# EAGLE design FatLight (EAGLE 7.2.0)

## Sheet 1 of 4: Prozessor
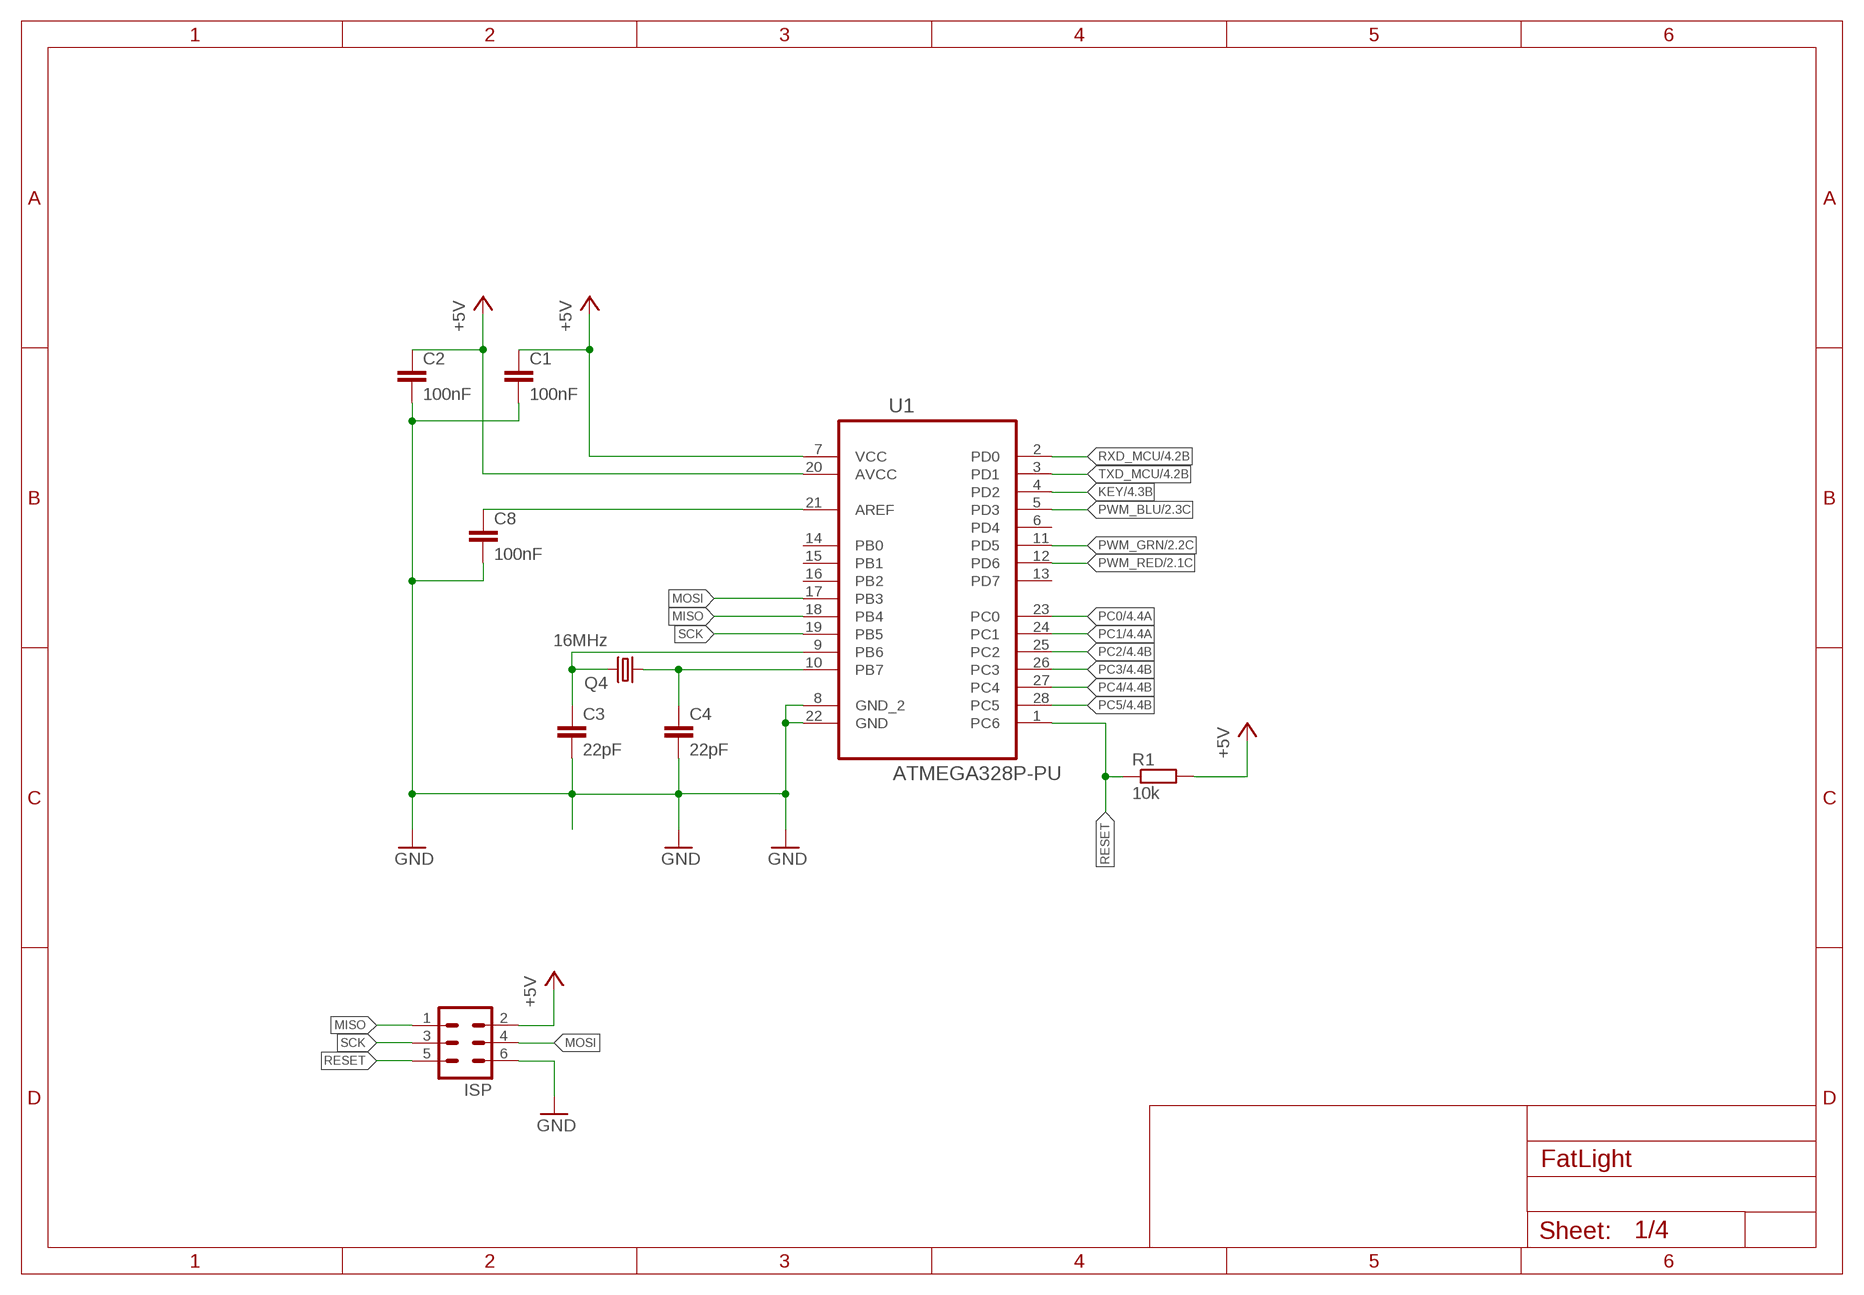
[diagram p0: schematic, sheet 1]

### Parts
C1  100nF  C-EU025-025X050  [C025-025X050]
C2  100nF  C-EU025-025X050  [C025-025X050]
C3  22pF  C-EU025-025X050  [C025-025X050]
C4  22pF  C-EU025-025X050  [C025-025X050]
C8  100nF  C-EU025-025X050  [C025-025X050]
ISP  ML6  [ML6]
Q4  16MHz  CRYSTALHC49S  [HC49/S]
R1  10k  R-EU_0207/7  [0207/7]
U1  ATMEGA328P-PU  [DIP254P762X457-28]

### Nets
+5V: C1.1 C2.1 ISP.2 R1.2 U1.7(VCC) U1.20(AVCC) ; also sheet 3,4
GND: C1.2 C2.2 C3.2 C4.2 C8.2 ISP.6 U1.8(GND_2) U1.22(GND) ; also sheet 2,3,4
KEY: U1.4(PD2) ; also sheet 4
MISO: ISP.1 U1.18(PB4)
MOSI: ISP.4 U1.17(PB3)
N$1: C4.1 Q4.1 U1.10(PB7)
N$2: C3.1 Q4.2 U1.9(PB6)
N$5: C8.1 U1.21(AREF)
PC0: U1.23(PC0) ; also sheet 4
PC1: U1.24(PC1) ; also sheet 4
PC2: U1.25(PC2) ; also sheet 4
PC3: U1.26(PC3) ; also sheet 4
PC4: U1.27(PC4) ; also sheet 4
PC5: U1.28(PC5) ; also sheet 4
PWM_BLU: U1.5(PD3) ; also sheet 2
PWM_GRN: U1.11(PD5) ; also sheet 2
PWM_RED: U1.12(PD6) ; also sheet 2
RESET: ISP.5 R1.1 U1.1(PC6)
RXD_MCU: U1.2(PD0) ; also sheet 4
SCK: ISP.3 U1.19(PB5)
TXD_MCU: U1.3(PD1) ; also sheet 4
Unconnected: U1.6(PD4) U1.13(PD7) U1.14(PB0) U1.15(PB1) U1.16(PB2)

## Sheet 2 of 4: PWM und Ausgabe
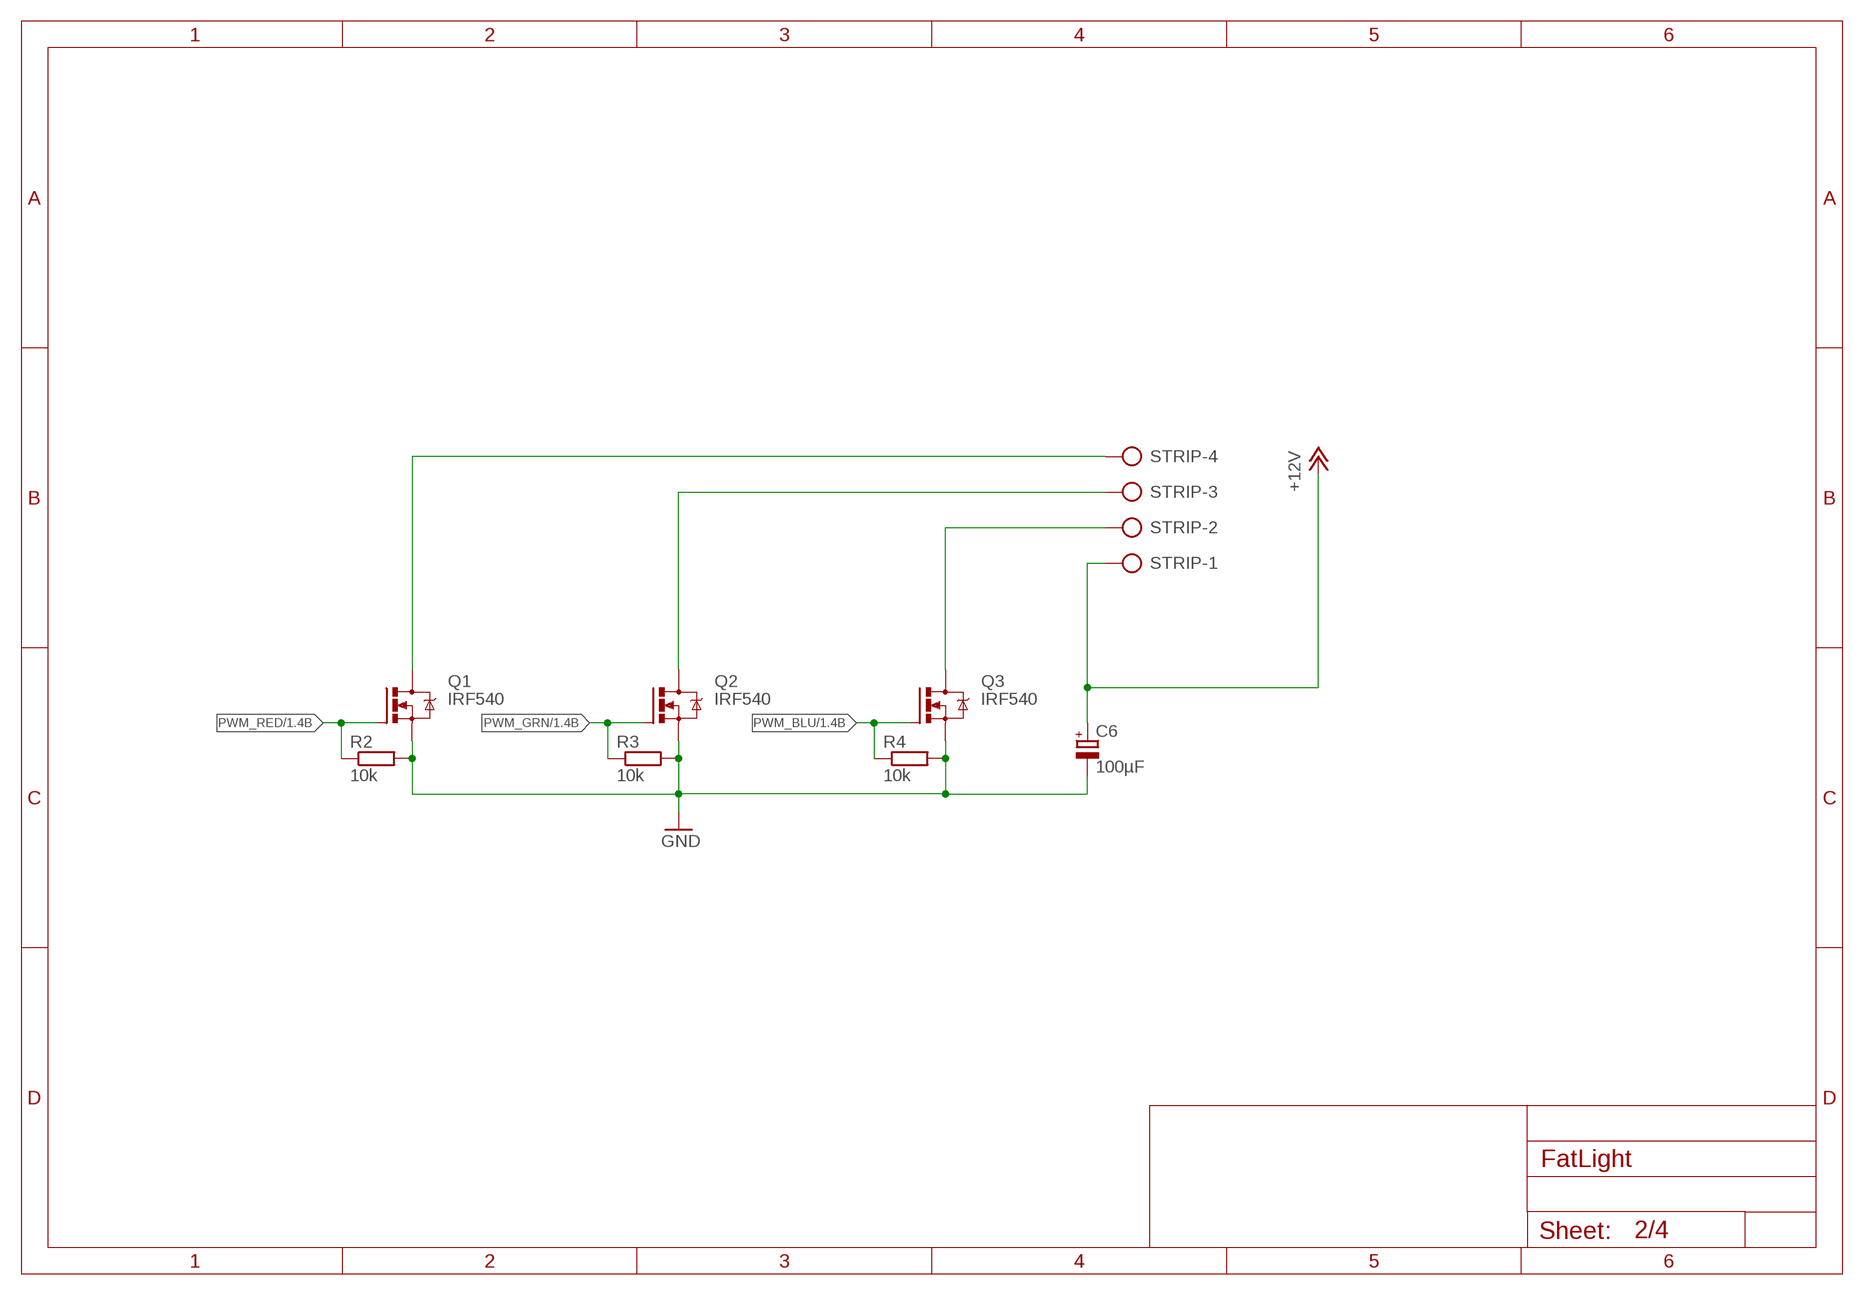
[diagram p1: schematic, sheet 2]

### Parts
C6  100µF  CPOL-EUE2.5-5  [E2,5-5]
Q1  IRF540  [TO220BV]
Q2  IRF540  [TO220BV]
Q3  IRF540  [TO220BV]
R2  10k  R-EU_0207/7  [0207/7]
R3  10k  R-EU_0207/7  [0207/7]
R4  10k  R-EU_0207/7  [0207/7]
STRIP  AK500/4  [AK500/4]

### Nets
+12V: C6.+ STRIP.1 ; also sheet 3
GND: C6.- Q1.S Q2.S Q3.S R2.2 R3.2 R4.2 ; also sheet 1,3,4
PWM_BLU: Q3.G R4.1 ; also sheet 1
PWM_GRN: Q2.G R3.1 ; also sheet 1
PWM_RED: Q1.G R2.1 ; also sheet 1
STRIP_BLU: Q3.D STRIP.2
STRIP_GRN: Q2.D STRIP.3
STRIP_RED: Q1.D STRIP.4

## Sheet 3 of 4: Stromversorgung
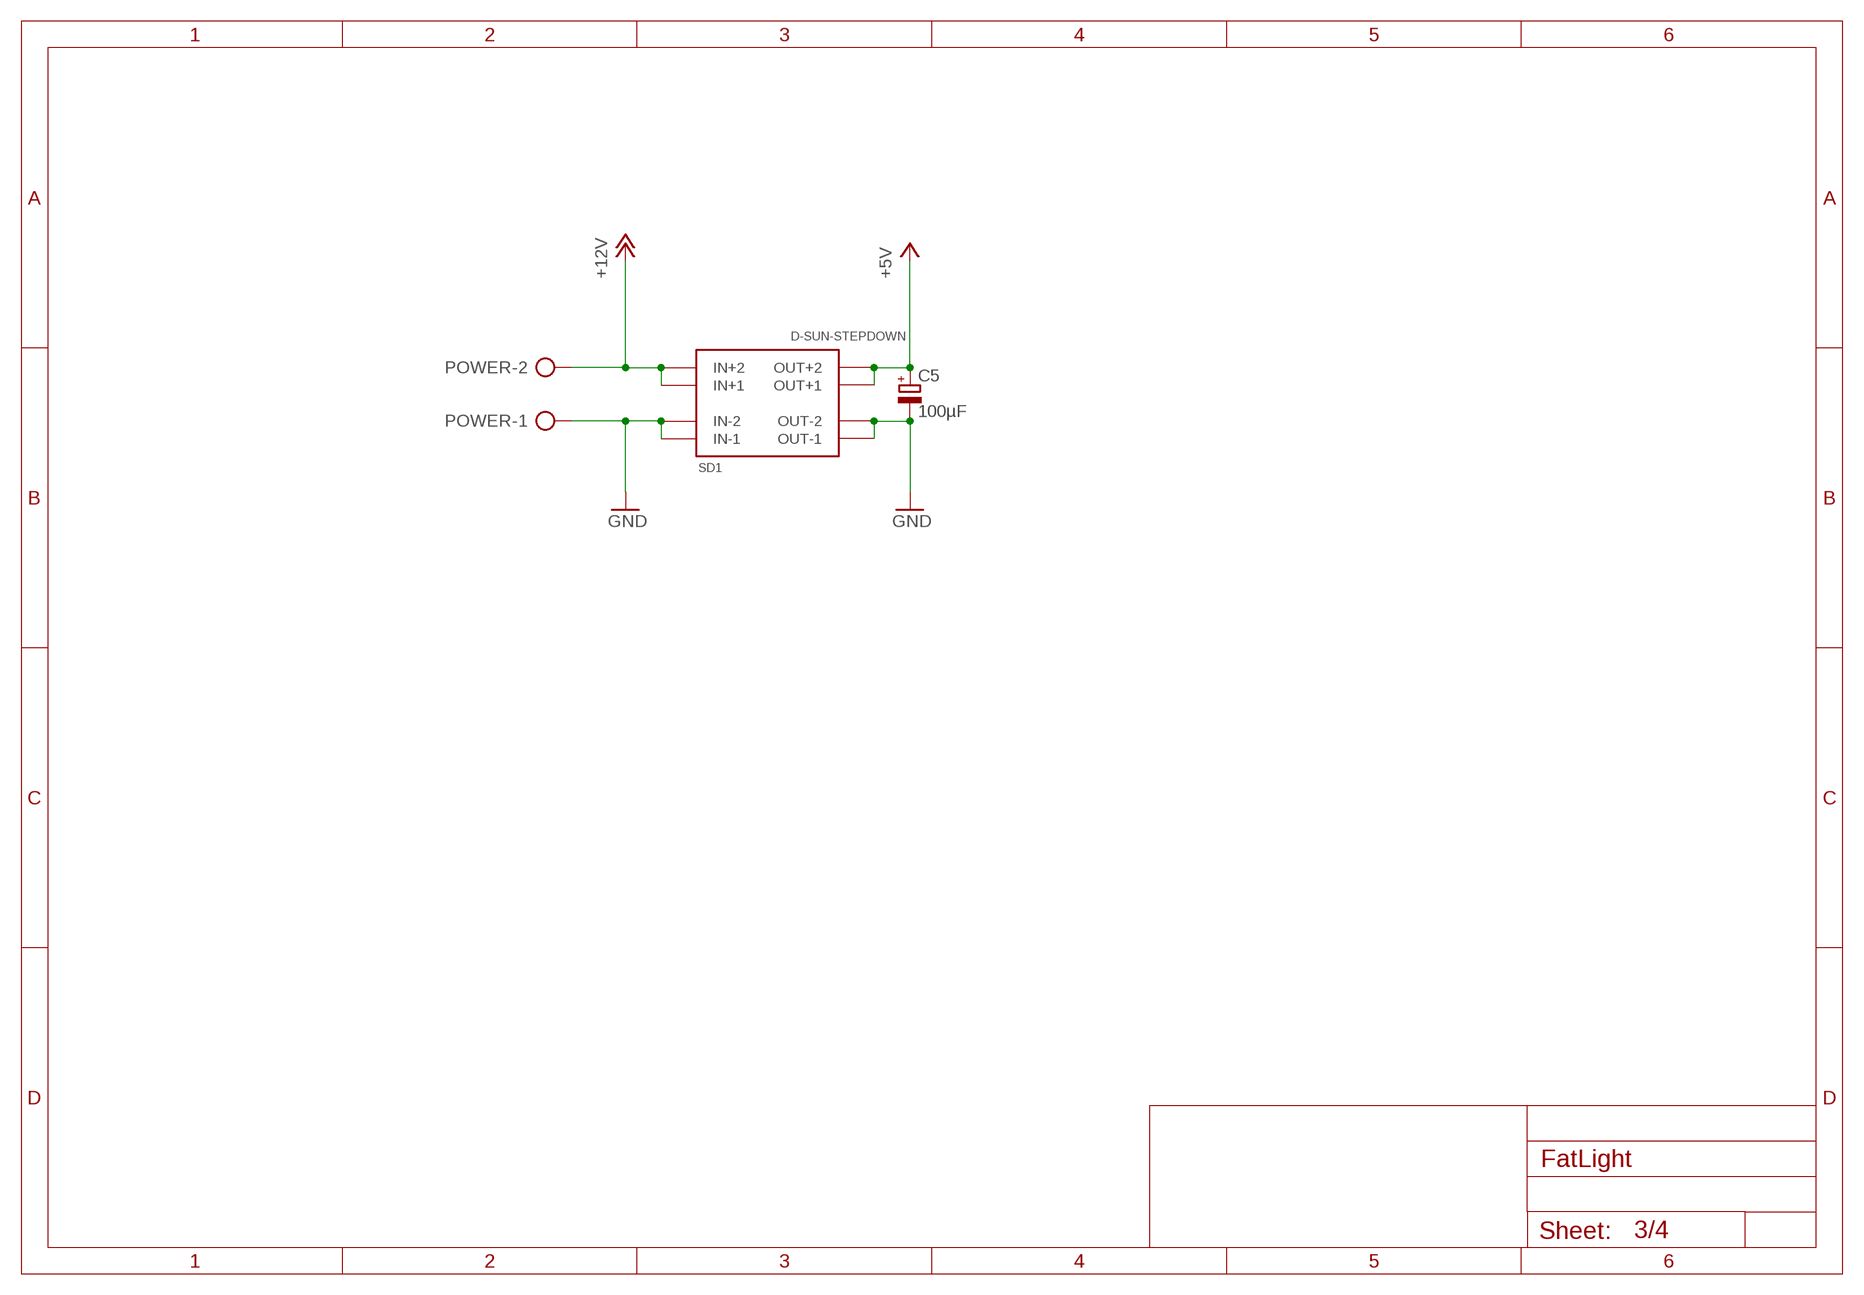
[diagram p2: schematic, sheet 3]

### Parts
C5  100µF  CPOL-EUE2.5-5  [E2,5-5]
POWER  AK500/2  [AK500/2]
SD1  D-SUN-STEPDOWN  [STEPDOWN-21X16]

### Nets
+5V: C5.+ SD1.OUT+1 SD1.OUT+2 ; also sheet 1,4
+12V: POWER.2 SD1.IN+1 SD1.IN+2 ; also sheet 2
GND: C5.- POWER.1 SD1.IN-1 SD1.IN-2 SD1.OUT-1 SD1.OUT-2 ; also sheet 1,2,4

## Sheet 4 of 4: Kommunikation
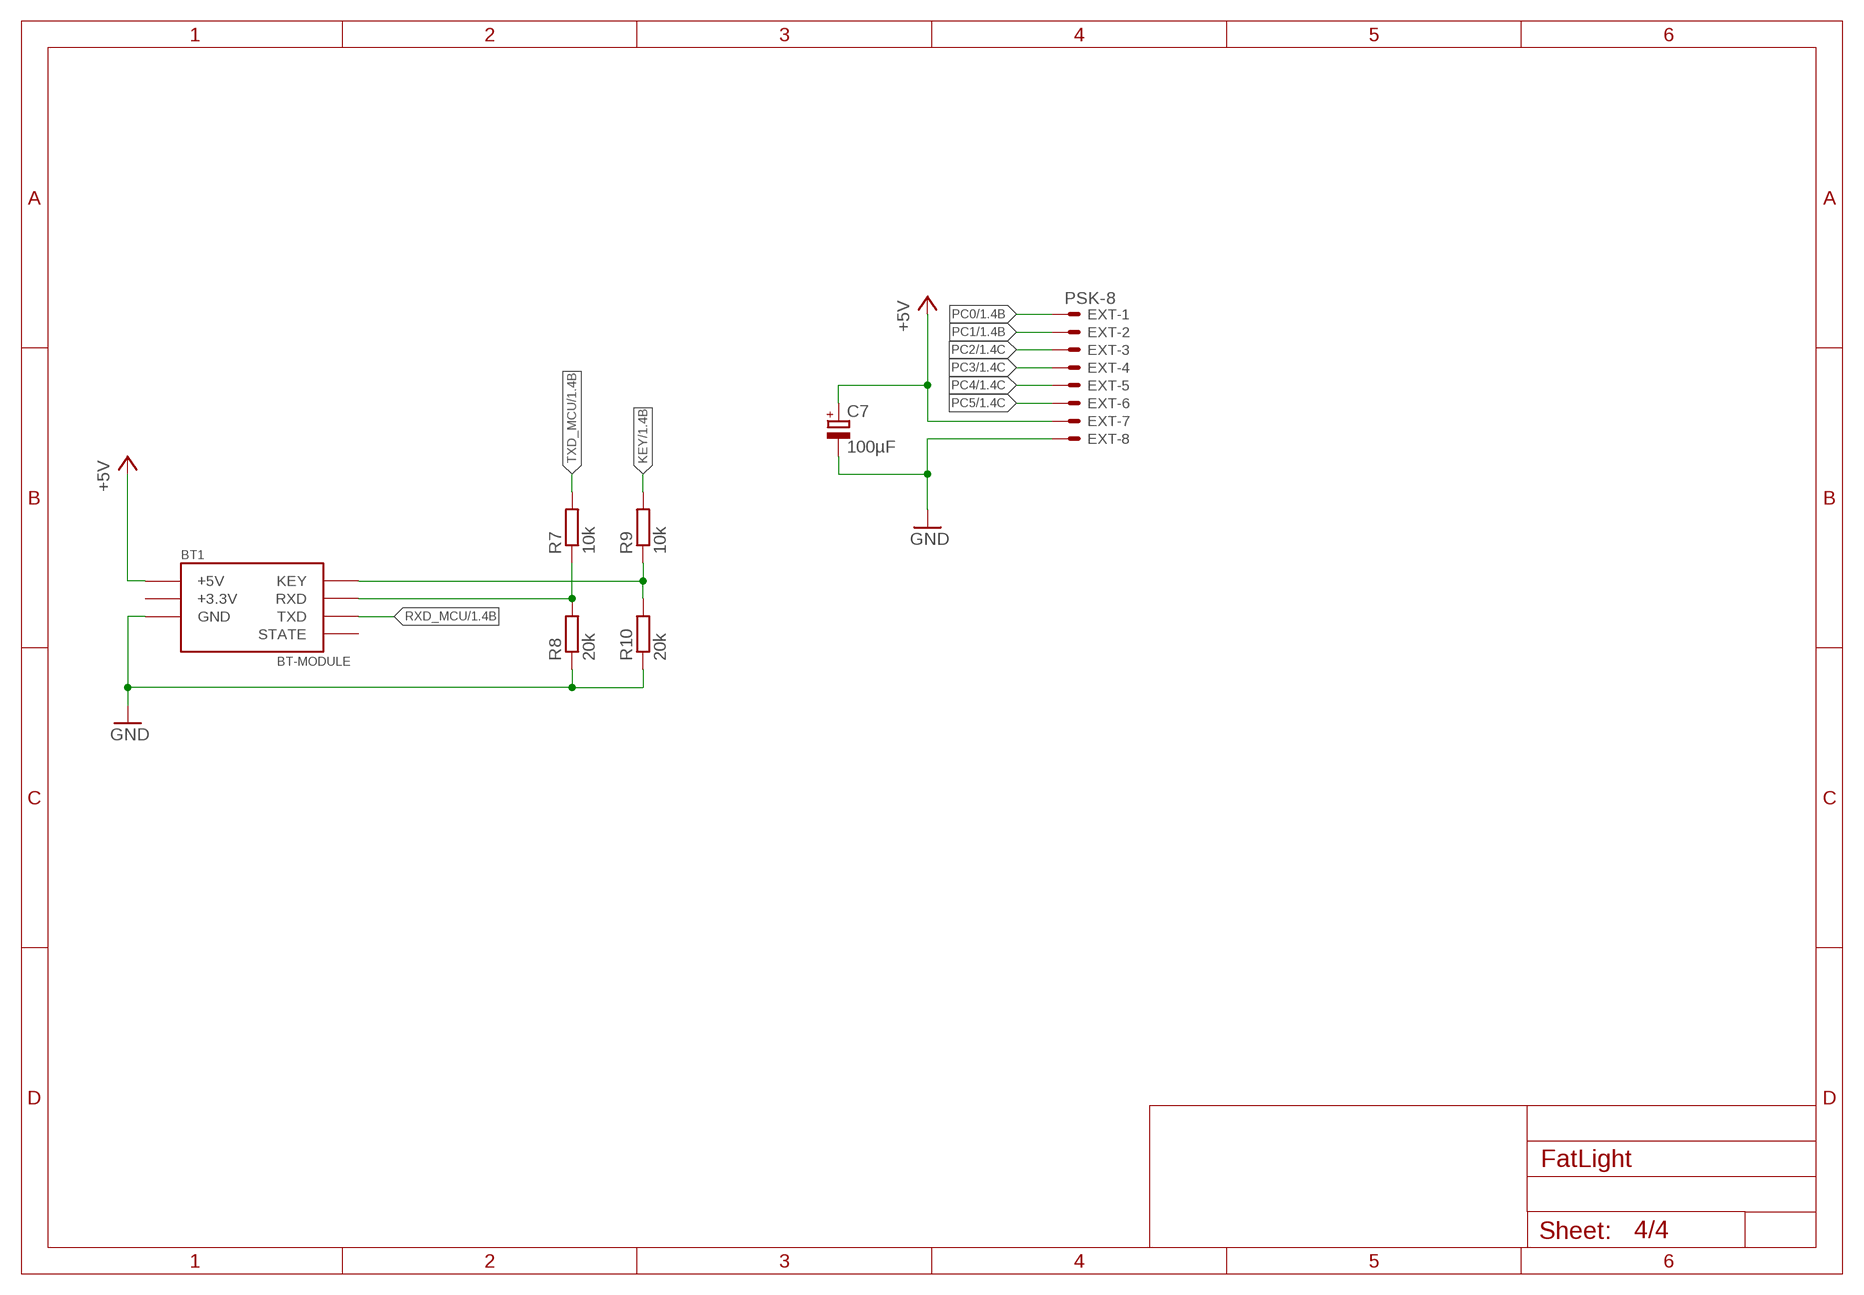
[diagram p3: schematic, sheet 4]

### Parts
BT1  BT-MODULE  [HC-05-6PIN]
C7  100µF  CPOL-EUE2.5-5  [E2,5-5]
EXT  PSK-8  22-23-2081  [22-23-2081]
R7  10k  R-EU_0207/7  [0207/7]
R8  20k  R-EU_0207/7  [0207/7]
R9  10k  R-EU_0207/7  [0207/7]
R10  20k  R-EU_0207/7  [0207/7]

### Nets
+5V: BT1.+5V BT1.+5V1(+5V) C7.+ EXT.7 ; also sheet 1,3
GND: BT1.GND BT1.GND1(GND) C7.- EXT.8 R8.1 R10.1 ; also sheet 1,2,3
KEY: R9.2 ; also sheet 1
N$3: BT1.KEY BT1.KEY1(KEY) R9.1 R10.2
N$4: BT1.RXD BT1.RXD1(RXD) R7.1 R8.2
PC0: EXT.1 ; also sheet 1
PC1: EXT.2 ; also sheet 1
PC2: EXT.3 ; also sheet 1
PC3: EXT.4 ; also sheet 1
PC4: EXT.5 ; also sheet 1
PC5: EXT.6 ; also sheet 1
RXD_MCU: BT1.TXD BT1.TXD1(TXD) ; also sheet 1
TXD_MCU: R7.2 ; also sheet 1
Unconnected: BT1.STATE

## Power pins joined to a net without a drawn wire
+3.3V: BT1.+3.3V

## Library data of the parts
BT1 = ZAP-Wireless:BT-MODULE
C1-C4 C8 = rcl:C-EU: CAPACITOR, European symbol
C5-C7 = rcl:CPOL-EU: POLARIZED CAPACITOR, European symbol
EXT = con-molex:22-23-2081: .100" (2.54mm) Center Header - 8 Pin; MF: MOLEX; MPN: 22-23-2081; OC_FARNELL: 1756826; OC_NEWARK: 01C7592
ISP = con-ml:ML6: HARTING; OC_FARNELL: unknown; OC_NEWARK: unknown
POWER = con-ptr500:AK500/2: CONNECTOR; OC_FARNELL: unknown; OC_NEWARK: unknown
Q1-Q3 = transistor-power:IRF540: HEXFET Power MOSFET
Q4 = crystal:CRYSTAL: CRYSTAL; OC_FARNELL: 1667008; OC_NEWARK: unknown
R1-R4 R7-R10 = rcl:R-EU_: RESISTOR, European symbol
SD1 = Zap-Powerconverters:D-SUN-STEPDOWN: Step-Down-Modul (D-Sun) Step-Down-Modul vom Ebay-Chinesen. Geht von 4,5V-28V auf 0,8V-20V, maximal 3A. Die Pins sind nicht 100% passend im Raster, lassen sich aber so hinbiegen, dass das nicht auffällt.
STRIP = con-ptr500:AK500/4: CONNECTOR; OC_FARNELL: unknown; OC_NEWARK: unknown
U1 = Zap-Mikrocontroller:ATMEGA328P-PU: 8-bit Microcontroller with In-System Programmable Flash; MPN: ATMEGA328P-PU; OC_FARNELL: 1715487; OC_NEWARK: 15R0268; PACKAGE: PDIP-28; SUPPLIER: Atmel

## Board
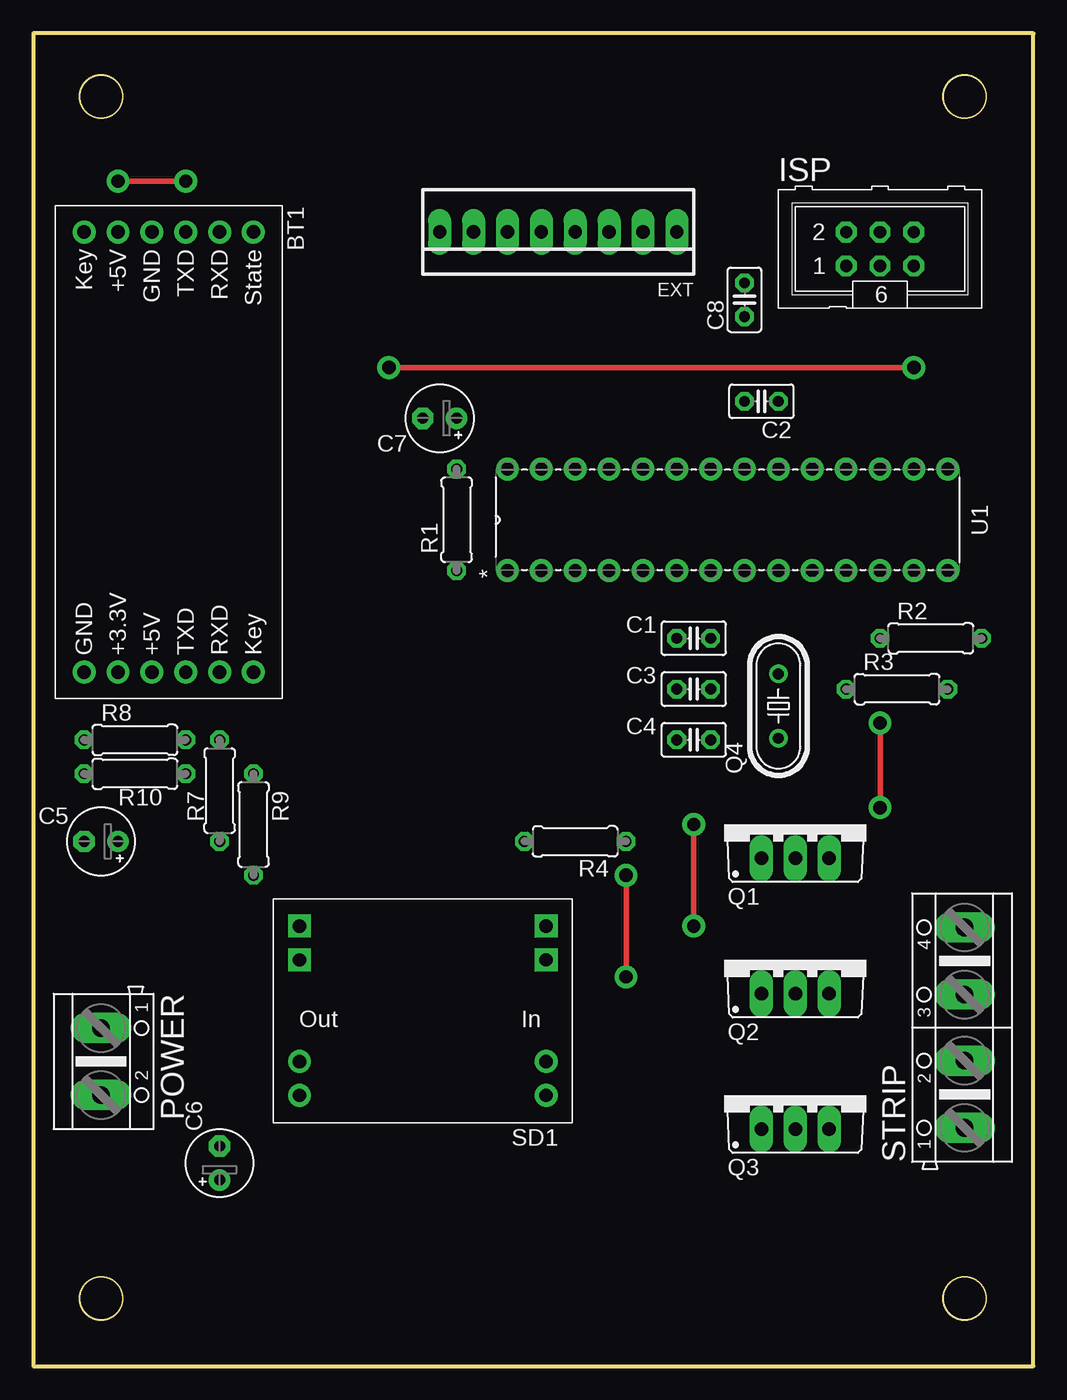
[diagram p4: board, top side]
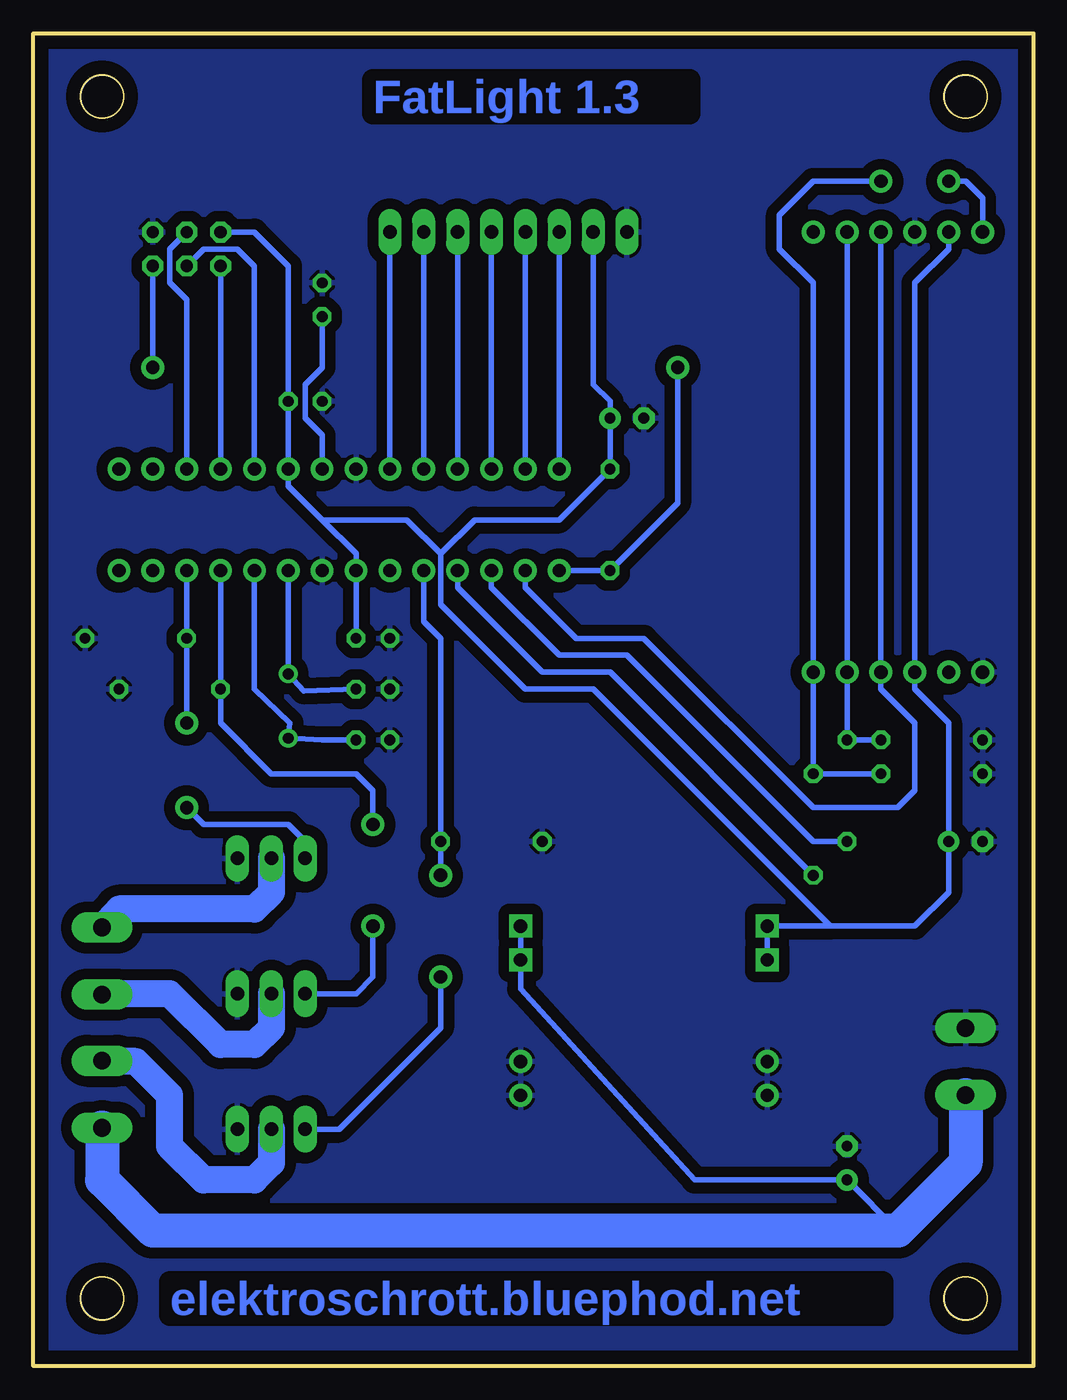
[diagram p5: board, bottom side, seen from below]

Size 75 x 100 mm. Coordinates in mm from the lower left corner, seen from the top.
Outline: 0,0 75,0 75,100 0,100 0,0
Outline: circle at 5.08,95.25 radius 1.6
Outline: circle at 69.85,95.25 radius 1.6
Outline: circle at 69.85,5.08 radius 1.6
Outline: circle at 5.08,5.08 radius 1.6
Copper layers (1*16): Top 0.035mm / dielectric 1.5mm / Bottom 0.035mm
Design rules "default *": minimum track width 10mil, minimum drill 24mil, track to track 8mil, track to pad 8mil, pad to pad 8mil, via to via 8mil, smd to smd 8mil, copper to edge 40mil, drill to drill 8mil, minimum pad ring 10mil, minimum via ring 8mil, stop-mask expansion 4mil, vias tented up to drill 0mil, thermal gap 10mil
Holes 3.2 mm at 69.85,95.25 5.08,5.08 5.08,95.25 69.85,5.08

### Footprints (pad centres in the part's own frame; a part is rotated, then mirrored left to right if it is on the bottom)
HC-05-6PIN = drill 1: +3.3V 16.51,-3.81; +5V 16.51,-1.27; +5V1 -16.51,-3.81; GND 16.51,-6.35; GND1 -16.51,-1.27; KEY 16.51,6.35; KEY1 -16.51,-6.35; RXD 16.51,3.81; RXD1 -16.51,3.81; STATE -16.51,6.35; TXD 16.51,1.27; TXD1 -16.51,1.27
C025-025X050 = drill 0.813 octagon: 1 -1.27,0; 2 1.27,0
E2,5-5 = drill 0.813 pad 1.6: + -1.27,0 | drill 0.813 pad 1.6 octagon: - 1.27,0
22-23-2081 = drill 1 long: 1 -8.89,0; 2 -6.35,0; 3 -3.81,0; 4 -1.27,0; 5 1.27,0; 6 3.81,0; 7 6.35,0; 8 8.89,0
ML6 = drill 0.914 octagon: 1 -2.54,-1.27; 2 -2.54,1.27; 3 0,-1.27; 4 0,1.27; 5 2.54,-1.27; 6 2.54,1.27
AK500/2 = drill 1.321 long: 1 -2.515,0; 2 2.515,0
TO220BV = drill 1.016 long: D 0,-2.54; G -2.54,-2.54; S 2.54,-2.54
HC49/S = drill 0.813: 1 -2.413,0; 2 2.413,0
0207/7 = drill 0.813 octagon: 1 -3.81,0; 2 3.81,0
STEPDOWN-21X16 = drill 1 square: IN+1 -9.25,-3.81; IN+2 -9.25,-6.35; OUT+1 9.25,-3.81; OUT+2 9.25,-6.35 | drill 1: IN-1 -9.25,6.35; IN-2 -9.25,3.81; OUT-1 9.25,6.35; OUT-2 9.25,3.81
AK500/4 = drill 1.321 long: 1 -7.518,0; 2 -2.489,0; 3 2.489,0; 4 7.518,0
DIP254P762X457-28 = drill 0.991: 1 -7.62,33.02; 2 -7.62,30.48; 3 -7.62,27.94; 4 -7.62,25.4; 5 -7.62,22.86; 6 -7.62,20.32; 7 -7.62,17.78; 8 -7.62,15.24; 9 -7.62,12.7; 10 -7.62,10.16; 11 -7.62,7.62; 12 -7.62,5.08; 13 -7.62,2.54; 14 -7.62,0; 15 0,0; 16 0,2.54; 17 0,5.08; 18 0,7.62; 19 0,10.16; 20 0,12.7; 21 0,15.24; 22 0,17.78; 23 0,20.32; 24 0,22.86; 25 0,25.4; 26 0,27.94; 27 0,30.48; 28 0,33.02

### Placement (x,y rotation side)
BT1  10.16,68.58 270 top
C1  49.53,54.61 180 top
C2  54.61,72.39 180 top
C3  49.53,50.8 180 top
C4  49.53,46.99 180 top
C5  5.08,39.37 180 top
C6  13.97,15.24 90 top
C7  30.48,71.12 180 top
C8  53.34,80.01 90 top
EXT  39.37,85.09 180 top
ISP  63.5,83.82 0 top
POWER  5.08,22.86 270 top
Q1  57.15,40.64 0 top
Q2  57.15,30.48 0 top
Q3  57.15,20.32 0 top
Q4  55.88,49.53 90 top
R1  31.75,63.5 90 top
R2  67.31,54.61 0 top
R3  64.77,50.8 0 top
R4  40.64,39.37 180 top
R7  13.97,43.18 270 top
R8  7.62,46.99 0 top
R9  16.51,40.64 270 top
R10  7.62,44.45 0 top
SD1  29.21,26.67 180 top
STRIP  69.85,25.4 90 top
U1  68.58,67.31 90 top

### Tracks (layer width: path | path; a pad name or v marks a point on that pad's centre or on a via)
+5V
  Bottom 0.406: C1.1 U1.7 50.8,60.96 53.34,63.5 | SD1.OUT+1 SD1.OUT+2 15.24,33.02 | 53.34,63.5 55.88,66.04 U1.20 C2.1 55.88,82.55 58.42,85.09 ISP.2 | 44.45,60.96 44.45,57.15 38.1,50.8 33.02,50.8 15.24,33.02 | 44.45,60.96 46.99,63.5 53.34,63.5 | BT1.+5V1 6.35,83.82 8.89,81.28 BT1.+5V 8.89,50.8 6.35,48.26 C5.+ 6.35,35.56 8.89,33.02 15.24,33.02 | 44.45,60.96 41.91,63.5 35.56,63.5 R1.2 C7.+ 31.75,72.39 33.02,73.66 EXT.7
+12V
  Bottom 0.406: 10.16,10.16 C6.+ 25.4,13.97 38.46,28.3 SD1.IN+1 SD1.IN+2
  Bottom 2.54: POWER.2 5.08,15.24 10.16,10.16 66.04,10.16 69.85,13.97 STRIP.1
GND
  pour Bottom (isolate 0.813): 0,100 75,100 75,0 0,0
KEY
  Bottom 0.406: R9.2 31.75,52.07 36.83,52.07 43.18,58.42 U1.4
MISO
  Bottom 0.406: ISP.1 U1.18
MOSI
  Bottom 0.406: ISP.4 64.77,83.82 64.77,81.28 63.5,80.01 U1.17
N$1
  Bottom 0.406: U1.10 58.42,50.8 55.75,48.26 Q4.1 53.34,46.99 C4.1
N$2
  Bottom 0.406: U1.9 Q4.2 54.74,50.67 C3.1
N$3  (via drill 1)
  Top 0.406: v6.35,88.9 v11.43,88.9
  Bottom 0.406: R10.2 R9.1 BT1.KEY 16.51,81.28 19.05,83.82 19.05,86.36 16.51,88.9 v11.43,88.9 | BT1.KEY1 3.81,87.63 5.08,88.9 v6.35,88.9
N$4
  Bottom 0.406: R8.2 R7.1 BT1.RXD BT1.RXD1
N$5
  Bottom 0.406: U1.21 53.34,69.85 54.61,71.12 54.61,73.66 53.34,74.93 C8.1
PC0
  Bottom 0.406: EXT.1 U1.23
PC1
  Bottom 0.406: EXT.2 U1.24
PC2
  Bottom 0.406: U1.25 EXT.3
PC3
  Bottom 0.406: U1.26 EXT.4
PC4
  Bottom 0.406: U1.27 EXT.5
PC5
  Bottom 0.406: EXT.6 U1.28
PWM_BLU  (via drill 1)
  Top 0.406: v44.45,36.83 v44.45,29.21
  Bottom 0.406: Q3.G 52.07,17.78 44.45,25.4 v44.45,29.21 | v44.45,36.83 R4.1 44.45,54.61 45.72,55.88 U1.5
PWM_GRN  (via drill 1)
  Top 0.406: v49.53,40.64 v49.53,33.02
  Bottom 0.406: U1.11 R3.1 60.96,48.26 57.15,44.45 50.8,44.45 49.53,43.18 v49.53,40.64 | Q2.G 50.8,27.94 49.53,29.21 v49.53,33.02
PWM_RED  (via drill 1)
  Top 0.406: v63.5,48.26 v63.5,41.91
  Bottom 0.406: U1.12 R2.1 v63.5,48.26 | Q1.G 54.61,39.37 55.88,40.64 62.23,40.64 v63.5,41.91
RESET  (via drill 1)
  Top 0.406: v66.04,74.93 v26.67,74.93
  Bottom 0.406: ISP.5 v66.04,74.93 | v26.67,74.93 26.67,64.77 R1.1 U1.1
RXD_MCU
  Bottom 0.406: BT1.TXD1 BT1.TXD 11.43,50.8 8.89,48.26 8.89,43.18 10.16,41.91 16.51,41.91 29.21,54.61 34.29,54.61 38.1,58.42 U1.2
SCK
  Bottom 0.406: ISP.3 62.23,83.82 59.69,83.82 58.42,82.55 U1.19
STRIP_BLU
  Bottom 2.032: Q3.D 57.15,15.24 58.42,13.97 62.23,13.97 64.77,16.51 64.77,20.32 67.31,22.86 69.8,22.86 STRIP.2
STRIP_GRN
  Bottom 2.032: Q2.D 57.15,25.4 58.42,24.13 60.96,24.13 64.77,27.94 69.8,27.94 STRIP.3
STRIP_RED
  Bottom 2.032: Q1.D 57.15,35.56 58.42,34.29 68.58,34.29 68.58,34.19 STRIP.4
TXD_MCU
  Bottom 0.406: R7.2 16.51,39.37 30.48,53.34 35.56,53.34 40.64,58.42 U1.3

### Text on the board
Bottom: FatLight 1.3 | elektroschrott.bluephod.net
tValues: +12/B/G/R